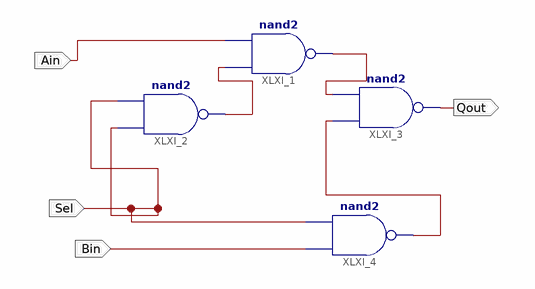
[diagram p0: schematic sheet 1]
// Xilinx ISE schematic onebitmux.sch (spartan3e) as structural Verilog: 4 symbols, 4 ports
module onebitmux (
  input  Ain,
  input  Bin,
  input  Sel,
  output Qout
);

  wire XLXN_8, XLXN_9, XLXN_20;

  nand XLXI_1 (XLXN_9, XLXN_20, Ain);
  nand XLXI_2 (XLXN_20, Sel, Sel);
  nand XLXI_3 (Qout, XLXN_8, XLXN_9);
  nand XLXI_4 (XLXN_8, Bin, Sel);
endmodule
